# Altium schematic sheet QSPI.SchDoc: Quad SPI Flash Memory (MICRON)
size A4; Date: 29-OCT-2015; Author: A.B; CompanyName: STMicroelectronics; Organization: MCD/TOOLS/GNB; Address1: 12, Rue Jules HOROWITZ; Address2: 38019 Grenoble; Address3: FRANCE; DocumentNumber: MB1225; Revision: B-01; SheetNumber: 7; SheetTotal: 13; Project: STM32F769I-DISCO
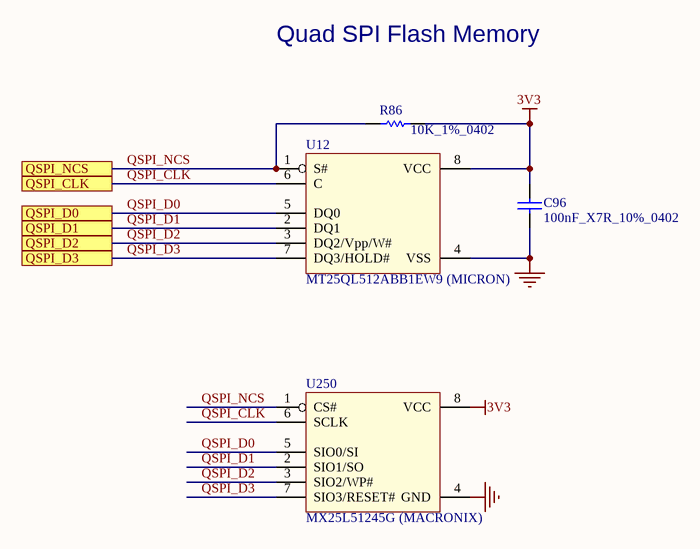
[diagram p0: QSPI.SchDoc]

## Parts
C96  100nF_X7R_10%_0402  [0402C]
R86  10K_1%_0402  [0402R]
U12  MT25QL512ABB1EW9 (MICRON)  [DFN8_1R27_6X8_TP4R8X5R16]
U250  MX25L51245G (MACRONIX)  [SON8_1R27_6X8]

## Ports
QSPI_CLK, QSPI_D0, QSPI_D1, QSPI_D2, QSPI_D3, QSPI_NCS

## Nets
3V3: C96.2 R86.2 U12.8(VCC) U250.8(VCC)
GND: C96.1 U12.4(VSS) U250.4(GND)
QSPI_CLK: U12.6(C) U250.6(SCLK) ; port QSPI_CLK
QSPI_D0: U12.5(DQ0) U250.5(SIO0/SI) ; port QSPI_D0
QSPI_D1: U12.2(DQ1) U250.2(SIO1/SO) ; port QSPI_D1
QSPI_D2: U12.3(DQ2/Vpp/W#) U250.3(SIO2/WP#) ; port QSPI_D2
QSPI_D3: U12.7(DQ3/HOLD#) U250.7(SIO3/RESET#) ; port QSPI_D3
QSPI_NCS: R86.1 U12.1(S#) U250.1(CS#) ; port QSPI_NCS

## Notes on the sheet
- Quad SPI Flash Memory
- Title:
- Project:
- Size:
- Revision:
- Variant:
- A4
- -
- Date:
- Reference:
- Sheet:
- of

## Library data of the parts
C96 = Cap_100nF_X7R_10%_0402: Capacitor,100nF,16V,X7R,10%,0402,YAGEO; Manuf_Part_1: CC0402KRX7R7BB104; Revision: July-2002: Re-released for DXP Platform.; Value: 100nF; Order: CC0402KRX7R7BB104; Manuf_1: YAGEO; ECCN_US/EU: n/a
R86 = Res_10K_1%_0402: Resistor,10K,0402,1%,YAGEO; Manuf_Part_1: RC0402FR-0710KL; Value: 10K; Manuf_1: YAGEO; Order: RC0402FR-0710KL; ECCN_US/EU: n/a
U12 = MT25QL512ABB1EW9: 512Mb, 3V, Multiple I/O Serial Flash Memory, Quad/Dual; Manuf_Part_2: N25Q512A13GF840E; Manuf_Part_1: MT25QL512ABB1EW9-0SIT; ECCN_US/EU: 3A991/NEC; Provided: ST; Ref St: xxxxxxxx; Note: MX25L51245GZ2I-08G can also be use but with a different footprint; Fitted: NO; Manuf_1: MICRON; Distrib: MICRON
U250 = MX25L51245G: 512Mb, 3V, Multiple I/O Serial Flash Memory, Quad/Dual; Manuf_Part_1: MX25L51245GZ2I-08G; Manuf_Part_2: MX25L51245GZ2I-10G; ECCN_US/EU: 3A991/NEC; Provided: Sub Co; Ref St: xxxxxxxxxx; Note: MT25QL512ABB1EW9 can be also used but with a different footprint; Manuf_1: MACRONIX; Distrib: MACRONIX